# EAGLE design MCU_bord (EAGLE 9.6.2)
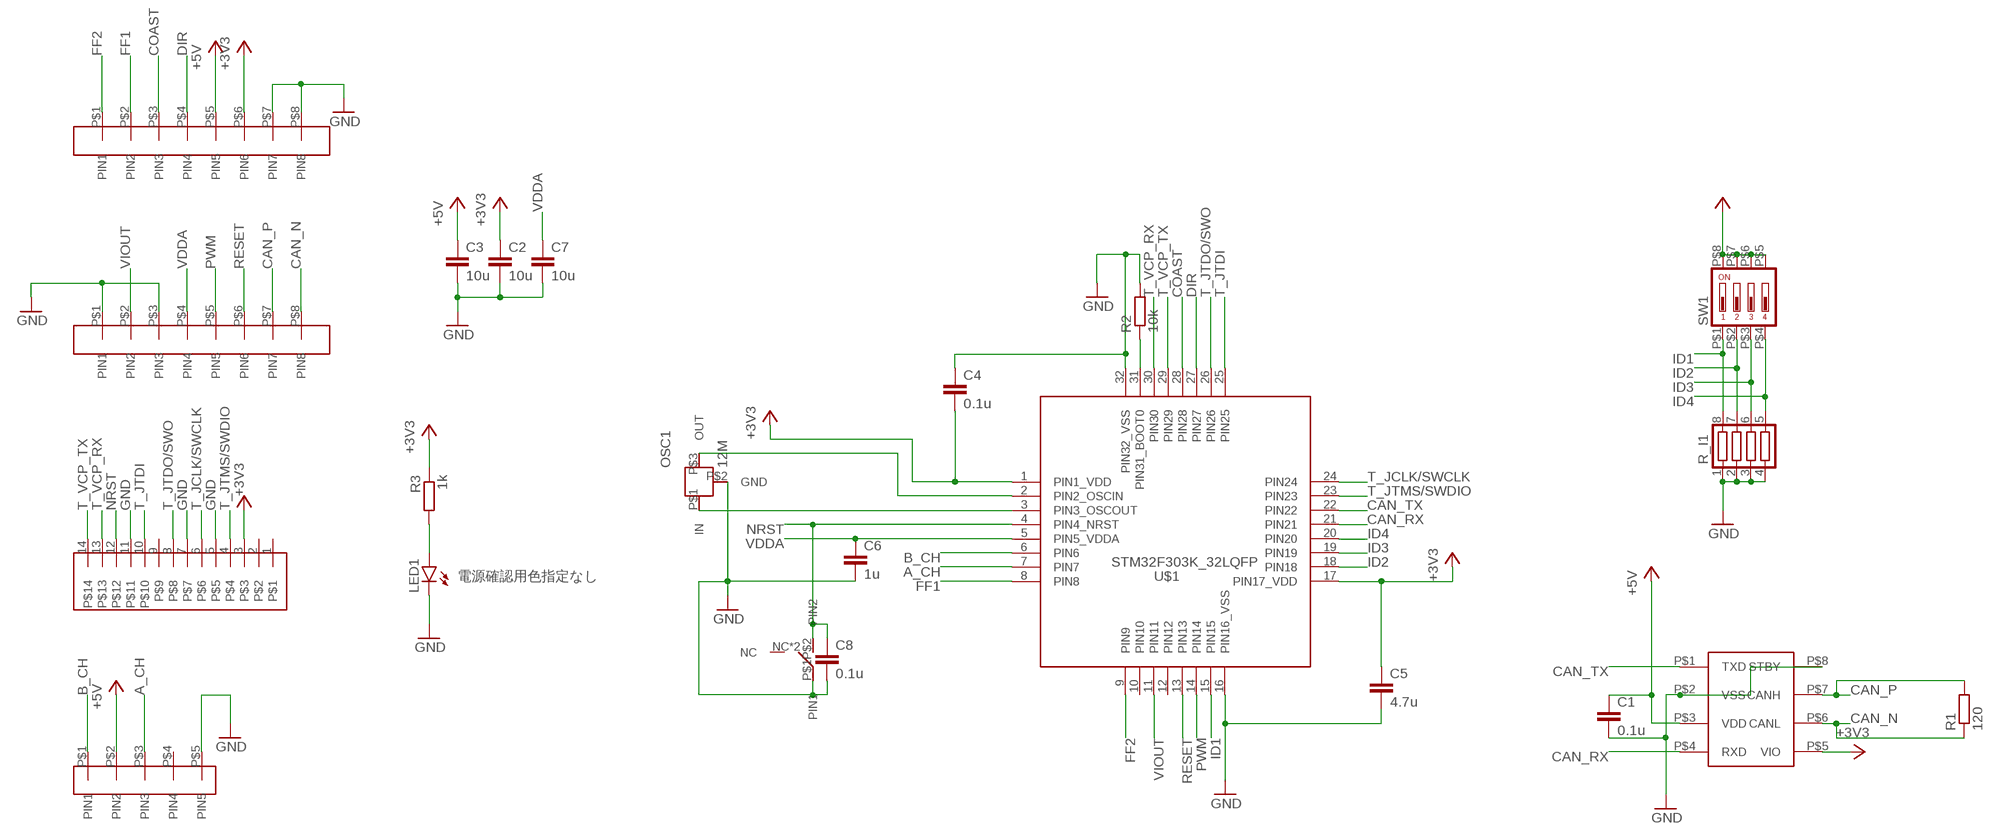
[diagram p0: schematic, sheet 1]

## Parts
C1  0.1u  C-EUC1608  [C1608]
C2  10u  C-EUC1608  [C1608]
C3  10u  C-EUC1608  [C1608]
C4  0.1u  C-EUC1608  [C1608]
C5  4.7u  C-EUC1608  [C1608]
C6  1u  C-EUC1608  [C1608]
C7  10u  C-EUC1608  [C1608]
C8  0.1u  C-EUC1608  [C1608]
CON1  JQ_S8P  [JQ_S8P]
CON2  JQ_S8P  [JQ_S8P]
CON3  XH_5P  [XH_5P]
IC1  MCP2562MCP2561-SN  [SOIC8]
LED1  1608LED  [1608]
OSC1  12M  CSTN#  [CSTNE#]
R1  120  R_REG  [1608]
R2  10k  R_REG  [1608]
R3  1k  R_REG  [1608]
R_I1  R_SHUGOU2  [1005X4RESISTOR]
SW1  DIPSW4  [DIPSW4]
U$1  STM32F303K_32LQFP  [LQFP32-7X7]
U$2  TAKUTOSUITTI2  [TAKUTOSUITTI2]
U$3  BOX14P  [CON_HEDA14P_1.27]

## Nets
+3V3: C2.1 C4.2 C5.1 CON1.P$6(PIN6) IC1.P$5(VIO) R3.1 SW1.P$5 SW1.P$6 SW1.P$7 SW1.P$8 U$1.1(PIN1_VDD) U$1.17(PIN17_VDD) U$3.3
+5V: C1.1 C3.1 CON1.P$5(PIN5) CON3.P$2(PIN2) IC1.P$3(VDD)
A_CH: CON3.P$3(PIN3) U$1.7(PIN7)
B_CH: CON3.P$1(PIN1) U$1.6(PIN6)
CAN_N: CON2.P$8(PIN8) IC1.P$6(CANL) R1.1
CAN_P: CON2.P$7(PIN7) IC1.P$7(CANH) R1.2
CAN_RX: IC1.P$4(RXD) U$1.21(PIN21)
CAN_TX: IC1.P$1(TXD) U$1.22(PIN22)
COAST: CON1.P$3(PIN3) U$1.28(PIN28)
DIR: CON1.P$4(PIN4) U$1.27(PIN27)
FF1: CON1.P$2(PIN2) U$1.8(PIN8)
FF2: CON1.P$1(PIN1) U$1.9(PIN9)
GND: C1.2 C2.2 C3.2 C4.1 C5.2 C6.2 C7.2 C8.2 CON1.P$7(PIN7) CON1.P$8(PIN8) CON2.P$1(PIN1) CON2.P$3(PIN3) CON3.P$5(PIN5) IC1.P$2(VSS) IC1.P$8(STBY) LED1.K OSC1.P$2(GND) R2.2 R_I1.1 R_I1.2 R_I1.3 R_I1.4 U$1.16(PIN16_VSS) U$1.32(PIN32_VSS) U$2.P$1(PIN1) U$3.5 U$3.7 U$3.11
ID1: R_I1.8 SW1.P$1 U$1.15(PIN15)
ID2: R_I1.7 SW1.P$2 U$1.18(PIN18)
ID3: R_I1.6 SW1.P$3 U$1.19(PIN19)
ID4: R_I1.5 SW1.P$4 U$1.20(PIN20)
N$1: OSC1.P$1(IN) U$1.3(PIN3_OSCOUT)
N$2: OSC1.P$3(OUT) U$1.2(PIN2_OSCIN)
N$3: R2.1 U$1.31(PIN31_BOOT0)
N$4: LED1.A R3.2
NRST: C8.1 U$1.4(PIN4_NRST) U$2.P$2(PIN2) U$3.12
PWM: CON2.P$5(PIN5) U$1.14(PIN14)
RESET: CON2.P$6(PIN6) U$1.13(PIN13)
T_JCLK/SWCLK: U$1.24(PIN24) U$3.6
T_JTDI: U$1.25(PIN25) U$3.10
T_JTDO/SWO: U$1.26(PIN26) U$3.8
T_JTMS/SWDIO: U$1.23(PIN23) U$3.4
T_VCP_RX: U$1.30(PIN30) U$3.13
T_VCP_TX: U$1.29(PIN29) U$3.14
VDDA: C6.1 C7.1 CON2.P$4(PIN4) U$1.5(PIN5_VDDA)
VIOUT: CON2.P$2(PIN2) U$1.11(PIN11)
Unconnected: CON3.P$4(PIN4) U$1.10(PIN10) U$1.12(PIN12) U$2.NC U$2.NC@2(NC) U$3.1 U$3.2 U$3.9

## Notes on the sheet
- 電源確認用色指定なし

## Library data of the parts
C1-C8 = rcl:C-EU: CAPACITOR, European symbol; SPICEPREFIX: C
CON1 CON2 = user_conector:JQ_S8P: jst JQコネクタ8pin ソケット 基板対基板コネクタ
CON3 = user_conector:XH_5P
IC1 = user_ic:MCP2562
LED1 = user_leds:1608LED: 1608LED
OSC1 = user_osc:CSTN#: ムラタのセラロック （セラミック振動子） 周波数はいくつか種類あり(valueで設定して) 秋月電子通商のトップ/パーツ一般/発振子/セラミック発振子 uCからのoutが入るのがinであることに注意 https://akizukidenshi.com/catalog/c/cceralock/
R1-R3 = user_rcl:R_REG: チップ抵抗
R_I1 = user_rcl:R_SHUGOU
SW1 = user_swich:DIPSW4: OTAX 表面実装4接点DIPスイッチ 秋月電子 通販コード : P-08929
U$1 = user_ic:STM32F303K_32LQFP
U$2 = user_swich:TAKUTOSUITTI2: 表面実装タクトスイッチ 秋月電子通称通販コード[P-14888]
U$3 = user_conector:BOX14P

## Board
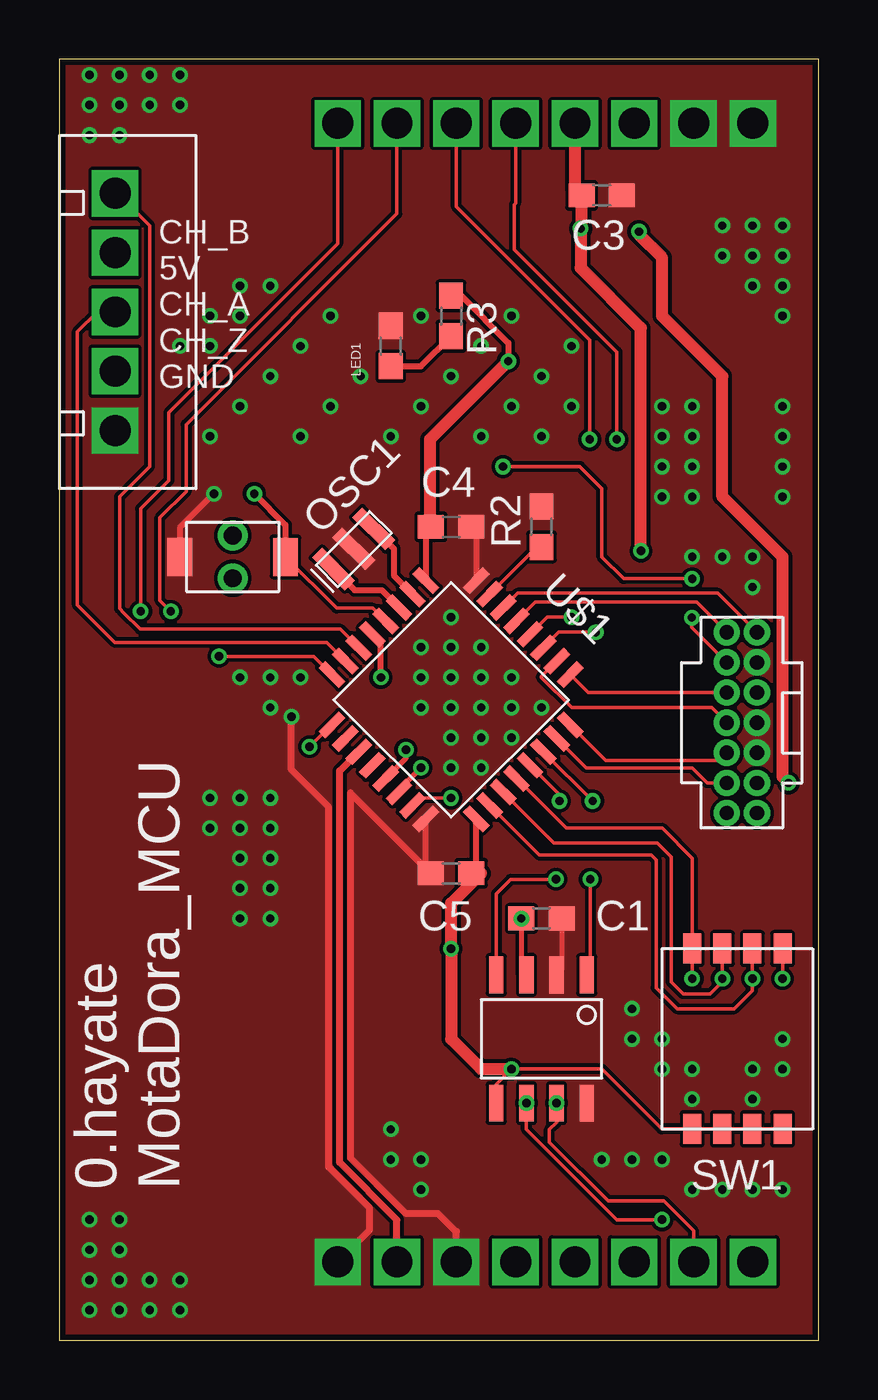
[diagram p1: board, top side]
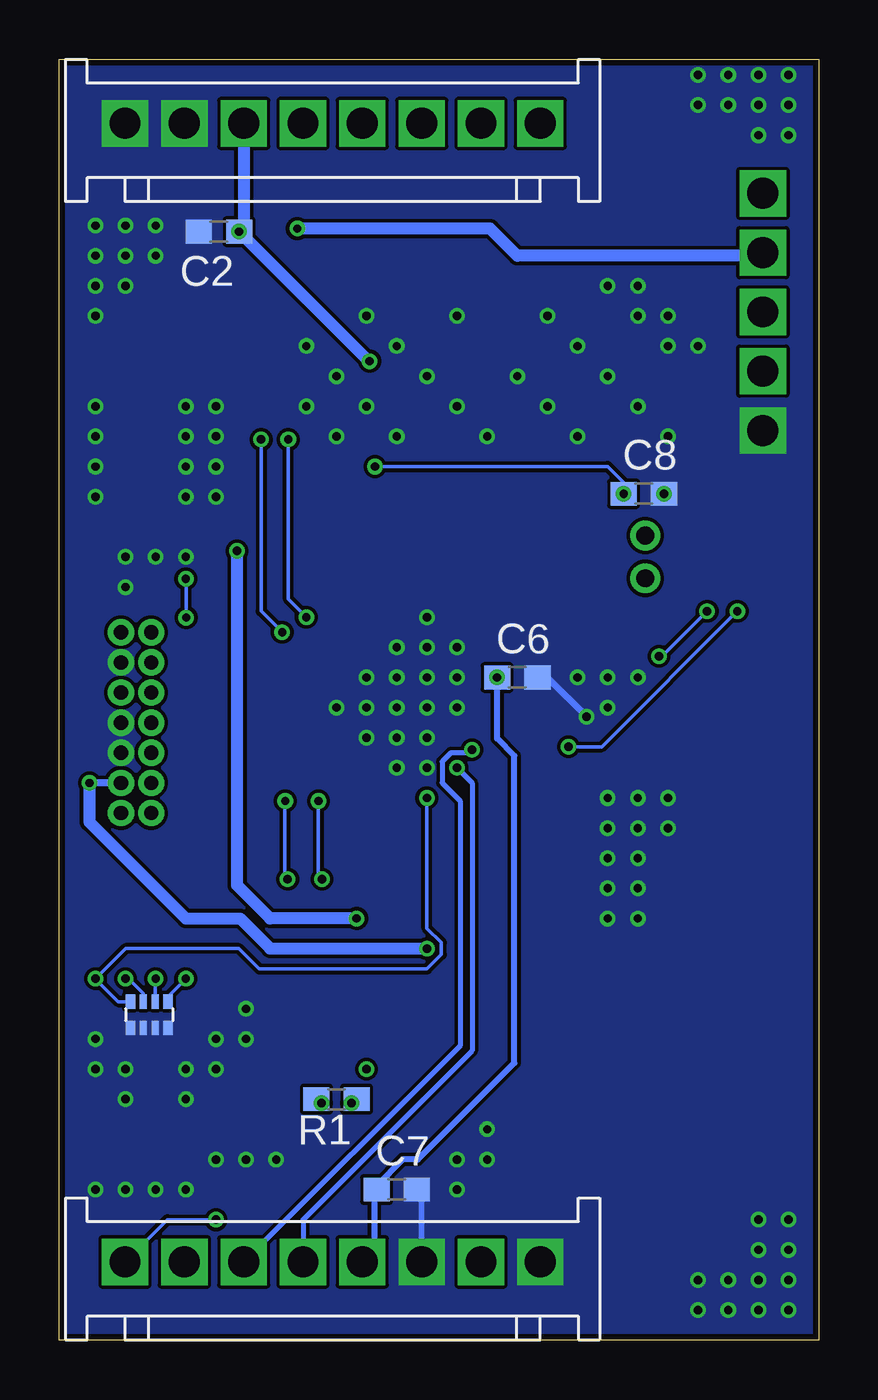
[diagram p2: board, bottom side, seen from below]

Size 32 x 54 mm. Coordinates in mm from the lower left corner, seen from the top.
Outline: 0,0 32,0 32,54 0,54 0,0
Copper layers (1*16): Top 0.035mm / dielectric 1.5mm / Bottom 0.035mm
Design rules "SeeedStudio_2layer_DRU_no_angle_20140221": minimum track width 6mil, minimum drill 12mil, track to track 6mil, track to pad 6mil, pad to pad 6mil, via to via 6mil, smd to smd 0mil, copper to edge 10mil, drill to drill 10mil, minimum pad ring 10mil, minimum via ring 6mil, stop-mask expansion 2mil, vias tented up to drill 100mil, thermal gap 10mil

### Footprints (pad centres in the part's own frame; a part is rotated, then mirrored left to right if it is on the bottom)
C1608 = smd 1.1 x 1: 1 -0.85,0; 2 0.85,0
JQ_S8P = drill 1.3 square: P$1 2.5,2.7; P$2 5,2.7; P$3 7.5,2.7; P$4 10,2.7; P$5 12.5,2.7; P$6 15,2.7; P$7 17.5,2.7; P$8 20,2.7
XH_5P = drill 1.3 square: P$1 2.45,2.35; P$2 4.95,2.35; P$3 7.45,2.35; P$4 9.95,2.35; P$5 12.45,2.35
SOIC8 = smd 1.55 x 0.6: P$1 -2.7,1.905; P$2 -2.7,0.635; P$3 -2.7,-0.635; P$4 -2.7,-1.905; P$5 2.7,-1.905; P$6 2.7,-0.635; P$7 2.7,0.635; P$8 2.7,1.905
1608 = smd 1.1 x 1: A -0.85,0; K 0.85,0
CSTNE# = smd 0.6 x 1.95: P$1 0,0; P$2 1.2,0; P$3 2.4,0
1608' = smd 1.1 x 1: 1 -0.85,0; 2 0.85,0
1005X4RESISTOR = smd 0.4 x 0.6: 1 0.2,-0.8; 4 1.8,-0.8; 5 1.8,0.3; 8 0.2,0.3 | smd 0.3 x 0.6: 2 0.75,-0.8; 3 1.25,-0.8; 6 1.25,0.3; 7 0.75,0.3
DIPSW4 = smd 0.76 x 1.27: P$1 -1.27,-3.81; P$2 0,-3.81; P$3 1.27,-3.81; P$4 2.54,-3.81; P$5 2.54,3.79; P$6 1.27,3.79; P$7 0,3.79; P$8 -1.27,3.79
LQFP32-7X7 = smd 1.2 x 0.4: 1 -4.3,2.8; 2 -4.3,2; 3 -4.3,1.2; 4 -4.3,0.4; 5 -4.3,-0.4; 6 -4.3,-1.2; 7 -4.3,-2; 8 -4.3,-2.8; 17 4.3,-2.8; 18 4.3,-2; 19 4.3,-1.2; 20 4.3,-0.4; 21 4.3,0.4; 22 4.3,1.2; 23 4.3,2; 24 4.3,2.8 | smd 0.4 x 1.2: 9 -2.8,-4.3; 10 -2,-4.3; 11 -1.2,-4.3; 12 -0.4,-4.3; 13 0.4,-4.3; 14 1.2,-4.3; 15 2,-4.3; 16 2.8,-4.3; 25 2.8,4.3; 26 2,4.3; 27 1.2,4.3; 28 0.4,4.3; 29 -0.4,4.3; 30 -1.2,4.3; 31 -2,4.3; 32 -2.8,4.3
TAKUTOSUITTI2 = drill 0.75: NC 2.225,-0.9; NC@2 2.225,0.9 | smd 1.05 x 1.6: P$1 0,0; P$2 4.45,0
CON_HEDA14P_1.27 = drill 0.6: 1 1.08,8.255; 2 2.35,8.255; 3 1.08,6.985; 4 2.35,6.985; 5 1.08,5.715; 6 2.35,5.715; 7 1.08,4.445; 8 2.35,4.445; 9 1.08,3.175; 10 2.35,3.175; 11 1.08,1.905; 12 2.35,1.905; 13 1.08,0.635; 14 2.35,0.635

### Placement (x,y rotation side)
C1  20.32,17.78 0 top
C2  25.27,46.74 180 bottom
C3  22.86,48.26 0 top
C4  16.51,34.29 180 top
C5  16.51,19.68 180 top
C6  12.7,27.94 0 bottom
C7  17.78,6.35 0 bottom
C8  7.37,35.69 0 bottom
CON1  9.23,54 180 bottom
CON2  9.23,6 180 bottom
CON3  0,50.8 270 top
IC1  20.32,12.7 270 top
LED1  13.97,41.91 90 top
OSC1  11.56,32.51 45 top
R1  120  [1608']  20.32,10.16 180 bottom
R2  10k  [1608']  20.32,34.29 90 top
R3  1k  [1608']  16.51,43.18 270 top
R_I1  29.21,13.97 0 bottom
SW1  29.21,12.7 180 top
U$1  16.51,27 315 top
U$2  5.08,33.02 0 top
U$3  30.48,30.48 180 top

### Tracks (layer width: path | path; a pad name or v marks a point on that pad's centre or on a via)
+3V3  (via drill 0.35)
  Top 0.152: IC1.P$5 18.41,10.79 v19.05,11.43 22.86,11.43 25.38,8.91 SW1.P$5 SW1.P$6 SW1.P$7 SW1.P$8
  Top 0.254: C4.2 15.58,34.21 15.45,34.08 U$1.1 | C5.1 17.57,19.9 U$1.17 | R3.1 16.93,44.03 18.92,42.04 v18.92,41.27
  Top 0.305: 17.78,19.68 C5.1
  Top 0.508: 15.58,34.21 15.62,34.25 15.62,37.97 v18.92,41.27 | 17.78,19.68 16.51,18.41 v16.51,16.51 16.51,12.7 17.78,11.43 v19.05,11.43 | C2.1 24.42,46.61 25.4,45.63 25.4,43.18 27.94,40.64 27.94,35.56 30.48,33.02 30.48,23.75 v30.73,23.5
  Bottom 0.305: U$3.3 v30.73,23.5
  Bottom 0.508: CON1.P$6 24.23,46.93 C2.1 18.96,41.27 v18.92,41.27 | v16.51,16.51 23.11,16.51 24.38,17.78 26.67,17.78 30.73,21.84 v30.73,23.5
  other vias: 24.42,46.74
+5V  (via drill 0.35)
  Top 0.152: 19.68,15.24 IC1.P$3
  Top 0.203: C1.1 19.47,15.46 19.68,15.24
  Top 0.508: CON1.P$5 21.73,48.54 C3.1 22.01,46.86 v21.97,46.86 21.97,45.21 24.51,42.67 v24.51,33.27
  Bottom 0.508: v21.97,46.86 13.84,46.86 12.7,45.72 2.48,45.72 CON3.P$2 | C1.1 23.11,17.78 24.51,19.18 v24.51,33.27
  other vias: 19.47,17.78
A_CH
  Top 0.152: U$1.7 11.27,29.41 2.34,29.41 0.77,30.98 0.77,42.53 1.59,43.35 CON3.P$3
B_CH
  Top 0.152: U$1.6 11.84,29.97 3.4,29.97 2.72,30.66 2.54,30.84 2.54,35.56 3.81,36.83 3.81,46.99 2.45,48.35 CON3.P$1
CAN_N  (via drill 0.35)
  Top 0.152: IC1.P$6 19.68,8.88 23.49,5.08 v25.4,5.08
  Bottom 0.152: CON2.P$8 27.45,5.08 v25.4,5.08
  Bottom 0.254: R1.1 19.52,10.16 IC1.P$6
  other vias: 19.68,10
CAN_P  (via drill 0.35)
  Top 0.152: v20.95,10 20.95,9.18 20.66,8.88 20.66,8.34 23.13,5.87 25.47,5.87 26.73,4.61 CON2.P$7
  Bottom 0.254: R1.2 21.01,10 v20.95,10
CAN_RX  (via drill 0.35)
  Top 0.152: U$1.21 21.08,22.99 v21.08,22.73 | v20.93,19.43 19.02,19.43 18.41,18.82 IC1.P$4
  Bottom 0.152: v21.08,22.73 21.08,19.43 v20.93,19.43
CAN_TX  (via drill 0.35)
  Top 0.152: U$1.22 v22.47,22.73 v22.48,22.73 | v22.38,19.43 22.38,15.55 IC1.P$1
  Bottom 0.152: v22.48,22.73 22.5,22.71 22.5,19.56 v22.38,19.43
COAST  (via drill 0.35)
  Top 0.152: U$1.28 20.56,30.48 v21.59,30.48 | v22.35,37.97 22.35,42.16 16.73,47.79 CON1.P$3
  Bottom 0.152: v21.59,30.48 22.35,31.24 v22.35,37.97
DIR  (via drill 0.35)
  Top 0.152: U$1.27 21.05,29.84 v22.61,29.84 | CON1.P$4 19.23,47.93 19.18,47.88 19.18,45.97 23.5,41.66 v23.5,37.97
  Bottom 0.152: v23.5,37.97 23.5,30.73 v22.61,29.84
FF1  (via drill 0.35)
  Top 0.152: v4.7,30.73 4.24,31.19 4.24,34.67 5.34,35.77 5.34,38.6 14.23,47.49 CON1.P$2 | U$1.8 10.72,28.83 v6.73,28.83
  Bottom 0.152: v6.73,28.83 6.6,28.83 v4.7,30.73
FF2  (via drill 0.35)
  Top 0.152: CON1.P$1 11.73,46.22 4.62,39.11 4.62,36.24 3.43,35.05 v3.43,30.73 | U$1.9 11.46,25.94 v10.54,25.02
  Bottom 0.152: v10.54,25.02 9.14,25.02 v3.43,30.73
GND  (via drill 0.35)
  Top 0.152: 22.44,10.21 IC1.P$8
  Top 0.203: C1.2 21.17,15.62 IC1.P$2
  Top 0.254: C8.2 5.08,34.25 U$2.P$1 | C4.1 17.57,34.08 U$1.32 | C5.2 15.45,19.9 U$1.16
  Top 0.305: CON2.P$1 13.08,4.65 13.08,5.58 11.35,7.3 11.35,22.48 9.78,24.05 v9.78,26.29 | CON2.P$3 16.73,4.57 15.97,5.33 14.62,5.33 12.27,7.68 12.27,23.08 C5.2
  Bottom 0.254: C7.2 16.73,6.15 CON2.P$3
  Bottom 0.305: v9.78,26.29 11.43,27.94 C6.2
  other vias: 6.52,35.69 1.27,53.34 2.54,53.34 3.81,53.34 5.08,53.34 5.08,52.07 3.81,52.07 2.54,52.07 1.27,52.07 1.27,50.8 2.54,50.8 13.97,38.1 15.24,39.37 17.78,38.1 19.05,39.37 20.32,38.1 21.59,39.37 26.67,39.37 26.67,33.02 29.21,31.75 26.67,35.56 29.21,33.02 27.94,33.02 25.4,7.62 24.13,7.62 22.86,7.62 26.67,6.35 27.94,6.35 29.21,6.35 30.48,6.35 15.24,6.35 15.24,7.62 13.97,7.62 13.97,8.89 5.08,2.54 5.08,1.27 3.81,1.27 2.54,1.27 1.27,1.27 1.27,2.54 1.27,3.81 1.27,5.08 2.54,5.08 2.54,3.81 2.54,2.54 3.81,2.54 7.62,17.78 8.89,17.78 8.89,19.05 7.62,19.05 8.89,20.32 7.62,20.32 7.62,21.59 8.89,21.59 8.89,22.86 7.62,22.86 6.35,22.86 6.35,21.59 16.51,24.13 17.78,24.13 19.05,25.4 20.32,26.67 19.05,26.67 17.78,25.4 16.51,25.4 16.51,26.67 17.78,26.67 15.24,26.67 15.24,27.94 16.51,27.94 17.78,27.94 19.05,27.94 17.78,29.21 16.51,29.21 15.24,29.21 16.51,30.48 21.59,41.91 26.67,38.1 25.4,38.1 25.4,36.83 25.4,35.56 26.67,36.83 7.62,27.94 8.89,27.94 10.16,27.94 8.89,26.67 6.35,38.1 7.62,39.37 8.89,40.64 10.16,41.91 11.43,43.18 10.16,38.1 11.43,39.37 12.7,40.64 15.24,43.18 16.51,40.64 17.78,41.91 19.05,43.18 20.32,40.64 27.94,46.99 29.21,46.99 30.48,46.99 30.48,45.72 30.48,44.45 30.48,43.18 29.21,44.45 29.21,45.72 27.94,45.72 30.48,39.37 30.48,38.1 30.48,36.83 30.48,35.56 25.4,12.7 24.13,12.7 25.4,11.43 26.67,11.43 29.21,10.16 29.21,11.43 30.48,11.43 26.67,10.16 30.48,12.7 24.13,13.97 25.4,39.37 8.89,44.45 7.62,43.18 6.35,43.18 7.62,44.45 6.35,41.91 5.08,41.91
  pour Top (no thermals): 0.13,53.85 31.75,53.85 31.75,0.13 0.13,0.13
  pour Bottom (no thermals): 0.13,53.85 31.75,53.85 31.75,0.13 0.13,0.13
ID1  (via drill 0.35)
  Top 0.152: v16.51,22.86 15.2,22.86 U$1.15 | SW1.P$1 v30.48,15.24
  Bottom 0.152: v16.51,22.86 16.51,17.37 15.9,16.76 15.9,16.26 16.52,15.65 23.57,15.65 24.28,16.36 24.41,16.49 24.43,16.51 29.21,16.51 v30.48,15.24 29.51,14.27 R_I1.8
ID2  (via drill 0.35)
  Top 0.152: U$1.18 20.23,20.45 24.94,20.45 25.15,20.24 25.15,14.86 26.04,13.97 28.45,13.97 29.21,14.73 v29.21,15.24 SW1.P$2
  Bottom 0.152: v29.21,15.24 29.08,15.24 28.46,14.62 R_I1.7
ID3  (via drill 0.35)
  Top 0.152: U$1.19 18.7,23.08 20.83,20.95 25.19,20.95 25.78,20.37 25.78,15.11 26.29,14.61 27.43,14.61 27.94,15.11 v27.94,15.24 SW1.P$3
  Bottom 0.152: v27.94,15.24 27.96,15.22 R_I1.6
ID4  (via drill 0.35)
  Top 0.152: v26.67,15.24 SW1.P$4 26.67,20.32 25.4,21.59 21.35,21.59 U$1.20
  Bottom 0.152: v26.67,15.24 27.41,14.5 R_I1.5
N$1
  Top 0.254: U$1.3 13.59,31.62 12.45,31.62 OSC1.P$1
N$2
  Top 0.254: OSC1.P$3 14.1,33.37 14.1,32.24 U$1.2
N$3
  Top 0.152: U$1.31 20.12,33.44 R2.1
N$4
  Top 0.254: LED1.A 15.24,41.06 R3.2
NRST  (via drill 0.35)
  Top 0.152: U$3.12 26.65,30.05 v26.65,30.46 | U$1.4 13.21,30.86 11.69,30.86 U$2.P$2 | v26.67,32.1 23.78,32.1 22.86,33.02 22.86,35.91 21.94,36.83 v18.7,36.83
  Top 0.254: C8.1 9.53,34.37 U$2.P$2
  Bottom 0.152: v26.65,30.46 26.65,32.09 v26.67,32.1 | v18.7,36.83 8.89,36.83 8.22,36.16 C8.1
  other vias: 8.22,35.69
PWM  (via drill 0.35)
  Top 0.203: U$1.14 14.32,23.21 v15.24,24.13
  Bottom 0.203: v15.24,24.13 14.61,23.5 14.61,12.2 21.73,5.08 CON2.P$5
RESET  (via drill 0.35)
  Top 0.203: U$1.13 14.61,24.53 v14.61,24.89
  Bottom 0.203: v14.61,24.89 14.73,24.76 15.5,24.76 15.87,24.39 15.87,23.49 15.11,22.73 15.11,12.42 CON2.P$6
T_JCLK/SWCLK
  Top 0.152: U$1.24 23.04,24.43 27.8,24.43 U$3.6
T_JTDI
  Top 0.152: U$3.10 22.29,27.3 U$1.25
T_JTDO/SWO
  Top 0.152: U$3.8 27.5,26.67 21.59,26.67 20.32,27.94 20.32,27.98 U$1.26
T_JTMS/SWDIO
  Top 0.152: U$1.23 22.21,24.13 26.67,24.13 27.3,23.5 U$3.4
T_VCP_RX
  Top 0.152: U$3.13 27.75,31.5 19.31,31.5 U$1.30
T_VCP_TX
  Top 0.152: U$3.14 26.86,31.11 20.06,31.11 U$1.29
VDDA  (via drill 0.35)
  Top 0.254: C6.1 13.55,29.39 U$1.5
  Bottom 0.254: C6.1 13.55,25.36 12.82,24.64 12.82,11.68 16.89,7.62 17.53,7.62 18.63,6.52 C7.1 18.72,6.26 18.72,3.81 CON2.P$4
  other vias: 13.55,27.94
VIOUT
  Top 0.305: CON2.P$2 14.23,5.07 11.81,7.49 11.81,24 U$1.11

### Text on the board
tPlace: CH_B / 5V / CH_A / CH_Z / GND | 0.hayate / MotaDora_MCU